# Altium schematic sheet SCHEMATIC1_CENTER.SchDoc
size Letter
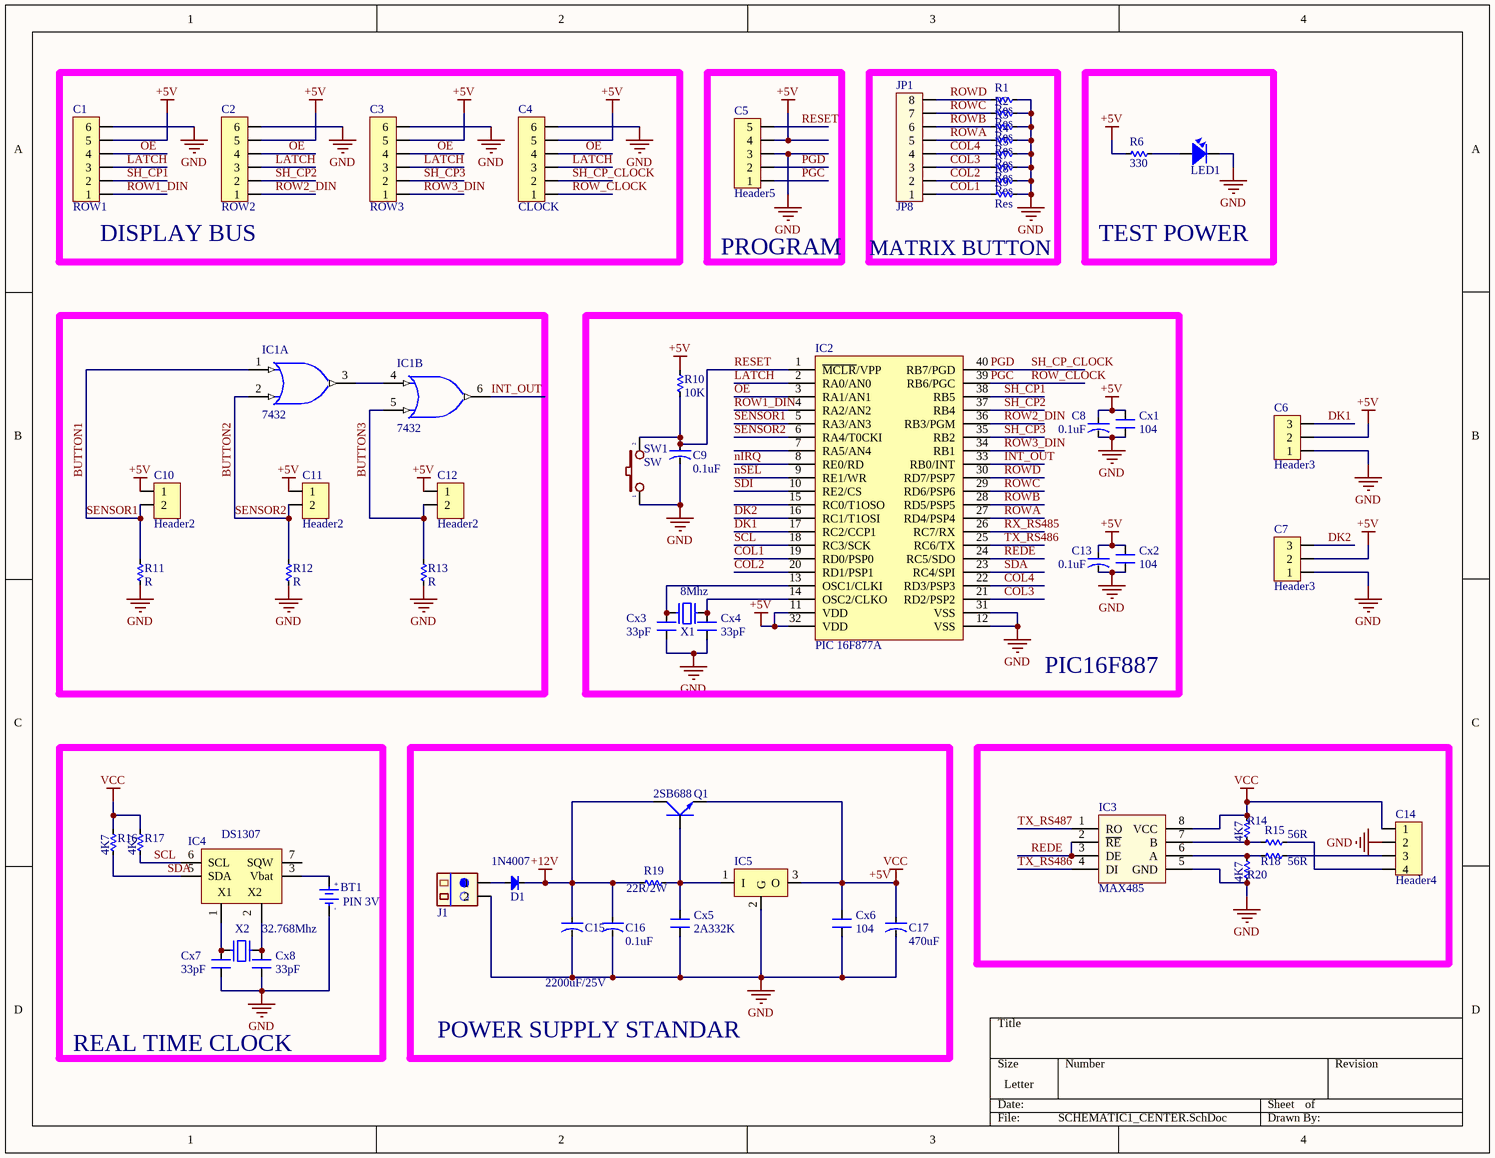
[diagram p0: SCHEMATIC1_CENTER.SchDoc]

## Parts
BT1  PIN 3V  [PIN3V]
C1  ROW1  [Header6]
C2  ROW2  [Header6]
C3  ROW3  [Header6]
C4  CLOCK  [Header6]
C5  Header5  [HDR5]
C6  Header3  [Header3]
C7  Header3  [Header3]
C8  0.1uF  [CAP-ALU-SMD-4.5x5x1.4]
C9  0.1uF  [CAP-ALU-SMD-4.5x5x1.4]
C10  Header2  [HDR2]
C11  Header2  [HDR2]
C12  Header2  [HDR2]
C13  0.1uF  [CAP-ALU-SMD-4.5x5x1.4]
C14  Header4  [Header4]
C15  2200uF/25V  [CA-ALU-13BL]
C16  0.1uF  [CAP-ALU-SMD-4.5x5x1.4]
C17  470uF  [CAP-ALU-SMD-4.5x5x1.4]
Cx1  104  [CN-SMD-0805]
Cx2  104  [CN-SMD-0805]
Cx3  33pF  [CN-SMD-0805]
Cx4  33pF  [CN-SMD-0805]
Cx5  2A332K  [CN4]
Cx6  104  [CN4]
Cx7  33pF  [CN-SMD-0805]
Cx8  33pF  [CN-SMD-0805]
D1  1N4007  [DIO-1A-SMALL]  (value not drawn)
IC1  7432  [DIP14]  (parts A,B of 4)
IC2  PIC 16F877A  [DIP40/W0.6]
IC3  MAX485  [DIP8]
IC4  DS1307  [DIP8]
IC5  LM7805  [TO220H1]  (value not drawn)
J1  CON.Domino2  [Domino 2M]  (value not drawn)
JP1  JP8  [Header8]
LED1  LED  [LED-0805-Blue]  (value not drawn)
Q1  2SB688  [TO220H1]
R1  Res  [RES-SMD-0805]
R2  Res  [RES-SMD-0805]
R3  Res  [RES-SMD-0805]
R4  Res  [RES-SMD-0805]
R5  Res  [RES-SMD-0805]
R6  330  [RES-SMD-0101]
R7  Res  [RES-SMD-0805]
R8  Res  [RES-SMD-0805]
R9  Res  [RES-SMD-0805]
R10  10K  [RES-SMD-0805]
R11  R  [RES-SMD-0101]
R12  R  [RES-SMD-0101]
R13  R  [RES-SMD-0101]
R14  4K7  [RES-SMD-0101]
R15  56R  [RES-1/2W]
R16  4K7  [RES-SMD-0101]
R17  4K7  [RES-SMD-0101]
R18  56R  [RES-1/2W]
R19  22R/2W  [RES-2W]
R20  4K7  [RES-SMD-0101]
SW1  SW  [SW1-SMD]
X1  8Mhz  [XT2]
X2  32.768Mhz  [XT2]

## Blocks framed on the sheet
DISPLAY BUS: C1-C4
PROGRAM: C5
MATRIX BUTTON: JP1 R1-R5 R7-R9
TEST POWER: LED1 R6
PIC16F887: C8 C9 C13 Cx1-Cx4 IC2 R10 SW1 X1
REAL TIME CLOCK: BT1 Cx7 Cx8 IC4 R16 R17 X2
POWER SUPPLY STANDAR: C15-C17 Cx5 Cx6 D1 IC5 J1 Q1 R19

## Nets
+5V: C1.5 C2.5 C3.5 C4.5 C5.4 C6.2 C7.2 C8.1 C10.1 C11.1 C12.1 C13.1 C14.1 C17.1 Cx1.2 Cx2.2 Cx6.2 IC1.14(VCC) IC2.11(VDD) IC2.32(VDD) IC3.8(VCC) IC4.8(VCC) IC5.3(O) Q1.3(E) R6.1 R10.1 R14.1 R16.1 R17.1  [also labelled VCC]
+12V: C15.1 C16.1 D1.2(K) Q1.2(C) R19.2
GND: BT1.2(GND) C1.6 C2.6 C3.6 C4.6 C5.3 C6.1 C7.1 C8.2 C9.2 C13.2 C14.2 C15.2 C16.2 C17.2 Cx1.1 Cx2.1 Cx3.1 Cx4.1 Cx5.1 Cx6.1 Cx7.1 Cx8.1 IC1.7(GND) IC2.12(VSS) IC2.31(VSS) IC3.5(GND) IC4.4(GND) IC5.2(G) J1.2 LED1.2 R1.1 R2.1 R3.1 R4.1 R5.1 R7.1 R8.1 R9.1 R11.2 R12.2 R13.2 R20.2 SW1.1
BUTTON1: C10.2 IC1.1(A) IC2.5(RA3/AN3) R11.1  [also labelled SENSOR1]
BUTTON2: C11.2 IC1.2(B) IC2.6(RA4/T0CKI) R12.1  [also labelled SENSOR2]
BUTTON3: C12.2 IC1.5(B) R13.1
COL1: IC2.19(RD0/PSP0) JP1.1 R9.2
COL2: IC2.20(RD1/PSP1) JP1.2 R8.2
COL3: IC2.21(RD2/PSP2) JP1.3 R7.2
COL4: IC2.22(RD3/PSP3) JP1.4 R5.2
DK1: C6.3 IC2.17(RC2/CCP1)
DK2: C7.3 IC2.16(RC1/T1OSI)
INT_OUT: IC1.6(Y) IC2.33(RB0/INT)
LATCH: C1.3 C2.3 C3.3 C4.3 IC2.2(RA0/AN0)
nIRQ: IC2.8(RE0/RD)
nSEL: IC2.9(RE1/WR)
OE: C1.4 C2.4 C3.4 C4.4 IC2.3(RA1/AN1)
PGC: C4.1 C5.1 IC2.39(RB6/PGC)  [also labelled ROW_CLOCK]
PGD: C4.2 C5.2 IC2.40(RB7/PGD)  [also labelled SH_CP_CLOCK]
REDE: IC2.24(RC5/SDO) IC3.2(~{RE}) IC3.3(DE)
RESET: C5.5 C9.1 IC2.1(~{MCLR}/VPP) R10.2 SW1.2
ROW1_DIN: C1.1 IC2.4(RA2/AN2)
ROW2_DIN: C2.1 IC2.36(RB3/PGM)
ROW3_DIN: C3.1 IC2.34(RB1)
ROWA: IC2.27(RD4/PSP4) JP1.5 R4.2
ROWB: IC2.28(RD5/PSP5) JP1.6 R3.2
ROWC: IC2.29(RD6/PSP6) JP1.7 R2.2
ROWD: IC2.30(RD7/PSP7) JP1.8 R1.2
RX_RS485: IC2.26(RC7/RX)
SCL: IC2.18(RC3/SCK) IC4.6(SCL) R17.2
SDA: IC2.23(RC4/SPI) IC4.5(SDA) R16.2
SDI: IC2.10(RE2/CS)
SH_CP1: C1.2 IC2.38(RB5)
SH_CP2: C2.2 IC2.37(RB4)
SH_CP3: C3.2 IC2.35(RB2)
TX_RS486: IC2.25(RC6/TX) IC3.4(DI)
TX_RS487: IC3.1(RO)
NetBT1_1: BT1.1(+3V) IC4.3(Vbat)
NetC14_3: C14.3 R18.1
NetC14_4: C14.4 R15.1
NetCx3_2: Cx3.2 IC2.13(OSC1/CLKI) X1.1
NetCx4_2: Cx4.2 IC2.14(OSC2/CLKO) X1.2
NetCx5_2: Cx5.2 IC5.1(I) Q1.1(B) R19.1
NetCx7_2: Cx7.2 IC4.1(X1) X2.1
NetCx8_2: Cx8.2 IC4.2(X2) X2.2
NetD1_1: D1.1(A) J1.1
NetIC1_3: IC1.3(Y) IC1.4(A)
NetIC3_6: IC3.6(A) R18.2 R20.1
NetIC3_7: IC3.7(B) R14.2 R15.2
NetLED1_1: LED1.1 R6.2

Not connected (* = marked no-connect by the designer): IC2 7(RA5/AN4) 15(RC0/T1OSO); IC4 7(SQW)

## Notes on the sheet
- 1N4007
- (in symbol PIN 3V) +; -

## Library data of the parts
BT1 = PIN 3V: Battery 3VDC; Value: PIN 3V
C1-C4 = Header6: Header IDC, 6 x 1 Pin Vertical 2.54mm Pitch (Non-Boxed, Male); Manufacturer: W¨¹rth Elektronik eiSos GmbH; partNo: 613002143121; ComponentLink1 Description: Manufacturer; ComponentLink2 Description: Datasheet; NoPins: 02; Created Date: 29 March 2013; ComponentLink1URL: http://www.we-online.com; ComponentLink2URL: http://katalog.we-online.de/em/datasheet/6130xx143121.pdf; Created by: Karrer Zheng
C5 = Header5: Header IDC, 5 x 1 Pin Vertical 2.54mm Pitch (Non-Boxed, Male); Manufacturer: W¨¹rth Elektronik eiSos GmbH; partNo: 613002143121; ComponentLink1 Description: Manufacturer; ComponentLink2 Description: Datasheet; NoPins: 02; Created Date: 29 March 2013; ComponentLink1URL: http://www.we-online.com; ComponentLink2URL: http://katalog.we-online.de/em/datasheet/6130xx143121.pdf; Created by: Karrer Zheng
C6 C7 = Header3: Header IDC, 3 x 1 Pin Vertical 2.54mm Pitch (Non-Boxed, Male); Manufacturer: W¨¹rth Elektronik eiSos GmbH; partNo: 613002143121; ComponentLink1 Description: Manufacturer; ComponentLink2 Description: Datasheet; NoPins: 02; Created Date: 29 March 2013; ComponentLink1URL: http://www.we-online.com; ComponentLink2URL: http://katalog.we-online.de/em/datasheet/6130xx143121.pdf; Created by: Karrer Zheng
C8 C9 C13 C15-C17 = CN-ALU-SMD: Polarized Capacitor (Axial); Published: 8-Jun-2000; LatestRevisionDate: 17-Jul-2002; LatestRevisionNote: Re-released for DXP Platform.; PackageReference: POLAR0.8; Publisher: Altium Limited
C10-C12 = Header2: Header IDC, 2 x 1 Pin Vertical 2.54mm Pitch (Non-Boxed, Male); Manufacturer: W¨¹rth Elektronik eiSos GmbH; partNo: 613002143121; ComponentLink1 Description: Manufacturer; ComponentLink2 Description: Datasheet; NoPins: 02; Created Date: 29 March 2013; ComponentLink1URL: http://www.we-online.com; ComponentLink2URL: http://katalog.we-online.de/em/datasheet/6130xx143121.pdf; Created by: Karrer Zheng
C14 = Header4: Header IDC, 4 x 1 Pin Vertical 2.54mm Pitch (Non-Boxed, Male); Manufacturer: W¨¹rth Elektronik eiSos GmbH; partNo: 613002143121; ComponentLink1 Description: Manufacturer; ComponentLink2 Description: Datasheet; NoPins: 02; Created Date: 29 March 2013; ComponentLink1URL: http://www.we-online.com; ComponentLink2URL: http://katalog.we-online.de/em/datasheet/6130xx143121.pdf; Created by: Karrer Zheng
Cx1 Cx2 Cx5 Cx6 = CN: Value: 33pF
Cx3 Cx4 Cx7 Cx8 = CN: Value: 33pF
D1 = Diode: Default Diode; Code - JEDEC: DO-214-AB; Value: 1N5007; Published: 8-Jun-2000; Revision: July-2002: Re-released for DXP Platform.; Publisher: Altium Limited
IC1 = 7432: Quad 2-Input OR Gate
IC2 = PIC16F877-PU: 8K FLASH, 368B RAM, 256B EFROM; Value: DIP 40; Value: PIC16F877A; Copyright by: VanDungEvn
IC3 = MAX485: RS232 - RS485 (Same sn75176)
IC4 = DS1307: Real Timer Serial; Value: DS1307
IC5 = LM78xx: Positive Voltage Regulator; Note: Tab is connected to pin 3 (GND).; Published: 24-Aug-2001; LatestRevisionDate: 17-Jul-2002; LatestRevisionNote: Re-released for DXP Platform.; DatasheetVersion: Apr-1994; PackageVersion: Jul-1998; PackageReference: ISOWATT220AB; Publisher: Altium Limited; PackageDescription: TO, Thru-Hole, Vertical, Heatsink Mounted; 3 In-Line Leads; Pitch 2.54 mm; Pin sequence 1, 3, 2; ComponentLink1Description: Manufacturer Link; ComponentLink1URL: http://www.st.com/; ComponentLink2Description: Datasheet; ComponentLink2URL: http://www.st.com/stonline/products/literature/ds/2146/l78m05c.pdf
J1 = CON.Domino2: 2 pins Domino Header; Publisher: Hoang Nguyen; ComponentLink1Description: Digikey Part link; ComponentLink2Description: Open DataSheet; ComponentLink2URL: H:\LIBRARY\LIBRARY.Datasheet\; Price: 2000VND
JP1 = Header8: Connector 8; Value: Connector 8
LED1 = LED SMD: Value: LED 3 - 5 ly 2 Colour
Q1 = TIP41C: NPN 2W, BCE; Value: TIP41C
R1-R14 R16 R17 R19 R20 = Res-SMD: Resistor; Manufacturer: Generic Components; Class: Passive; Published: 08/06/2000; Publisher: Altium Hobart Technology Centre
R15 R18 = Res: Manufacturer: Generic Components; Class: Passive; SubClass: R; Published: 08/06/2000; Publisher: Altium Hobart Technology Centre
SW1 = SW2: Switch button 2 pin; Value: SW chip 2 pin
X1 X2 = XT2: Crystal, 32.768 KHz, -40 to 85 degC, 3.2 x 1.5 x 0.9 mm SMD; Value: 4Mhz